# Altium project Emerald_7020.PrjPcb
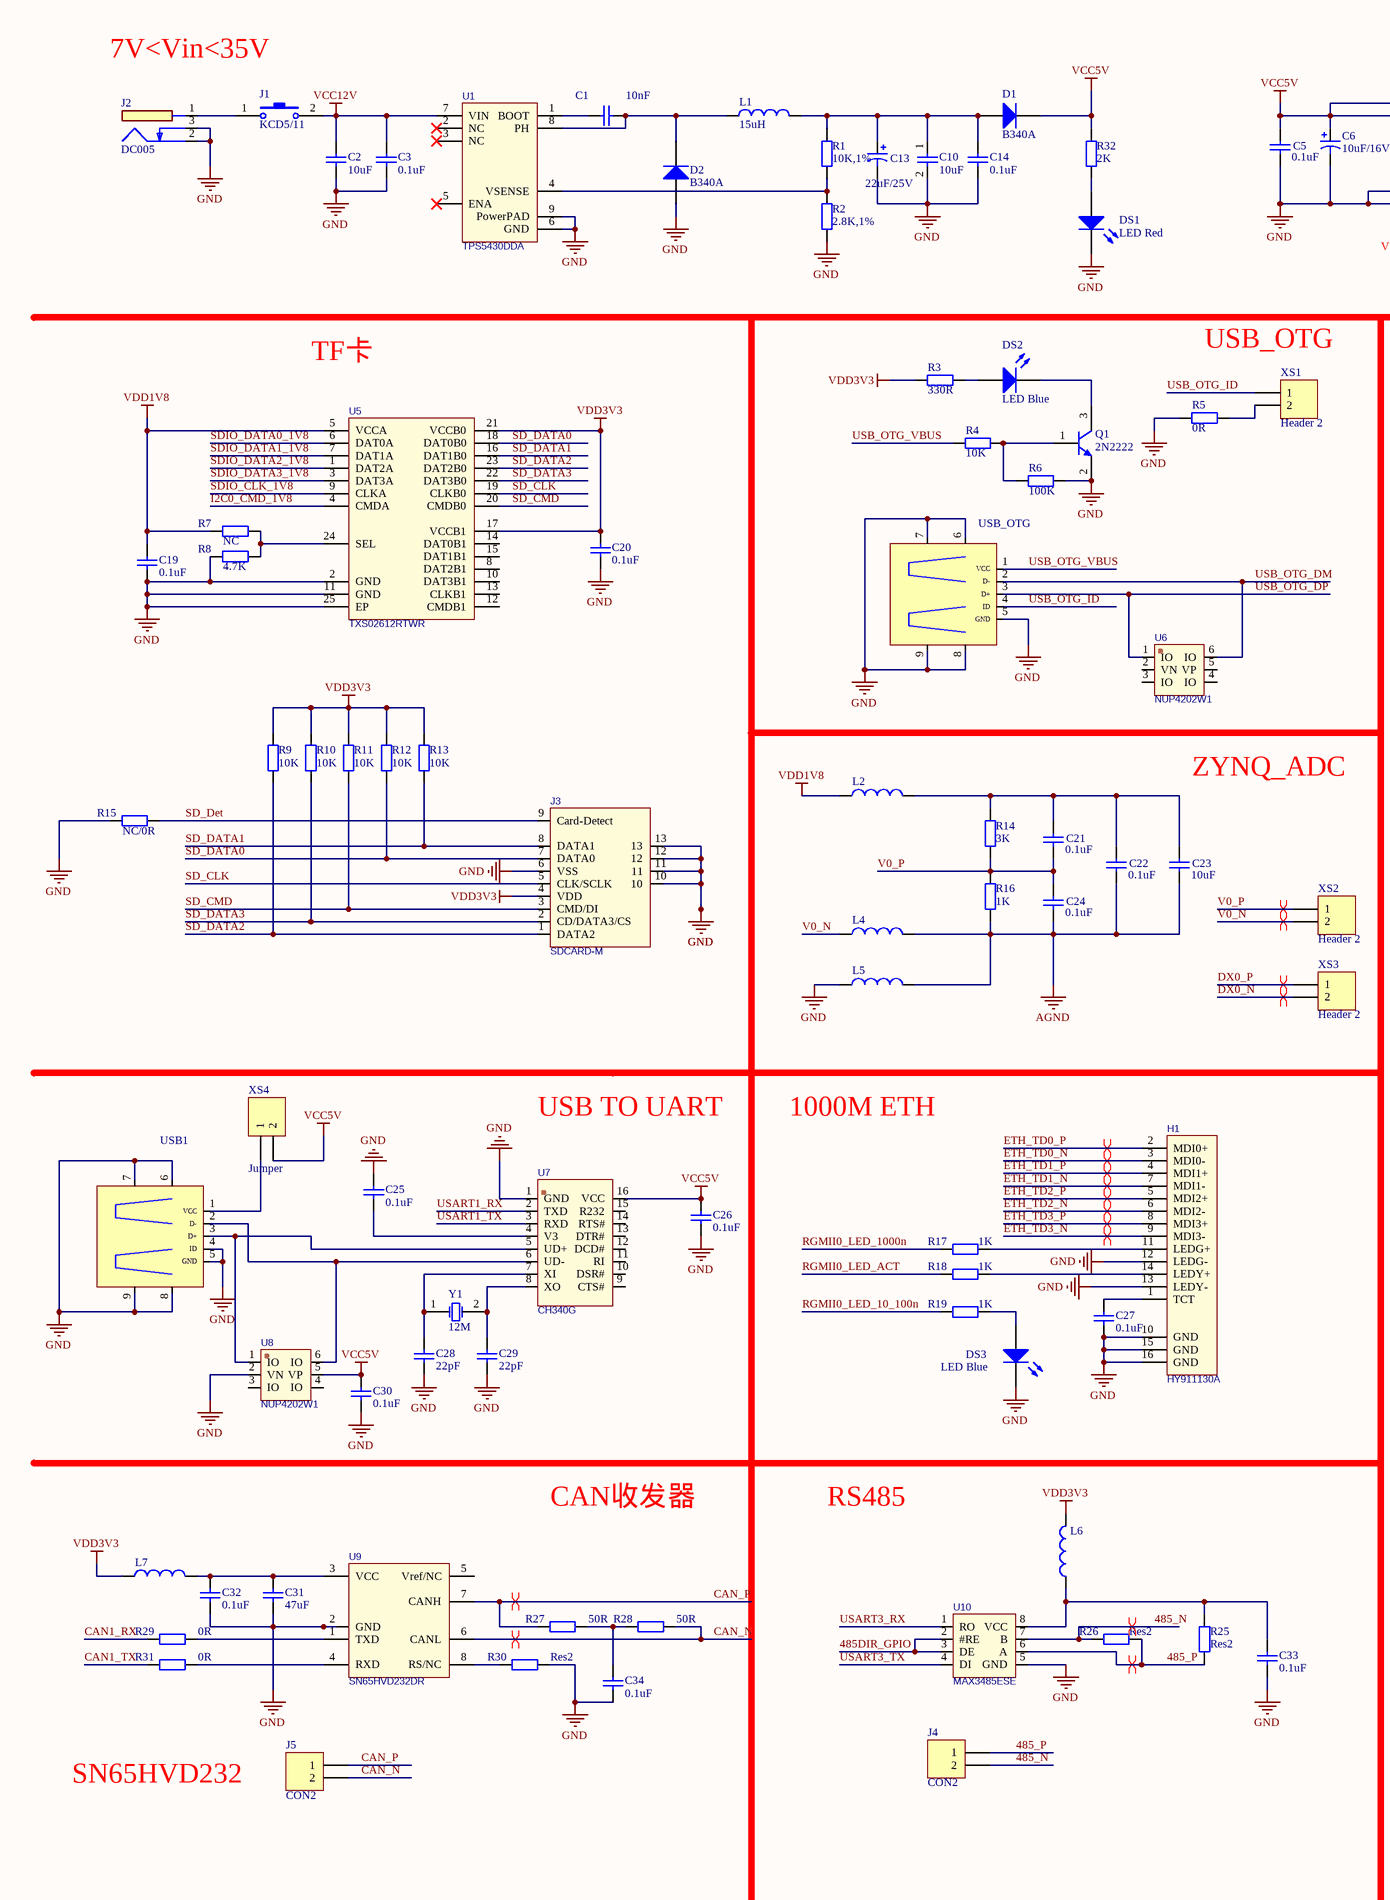
[diagram p0: ZYNQ_Motherboard_final.SchDoc, left]
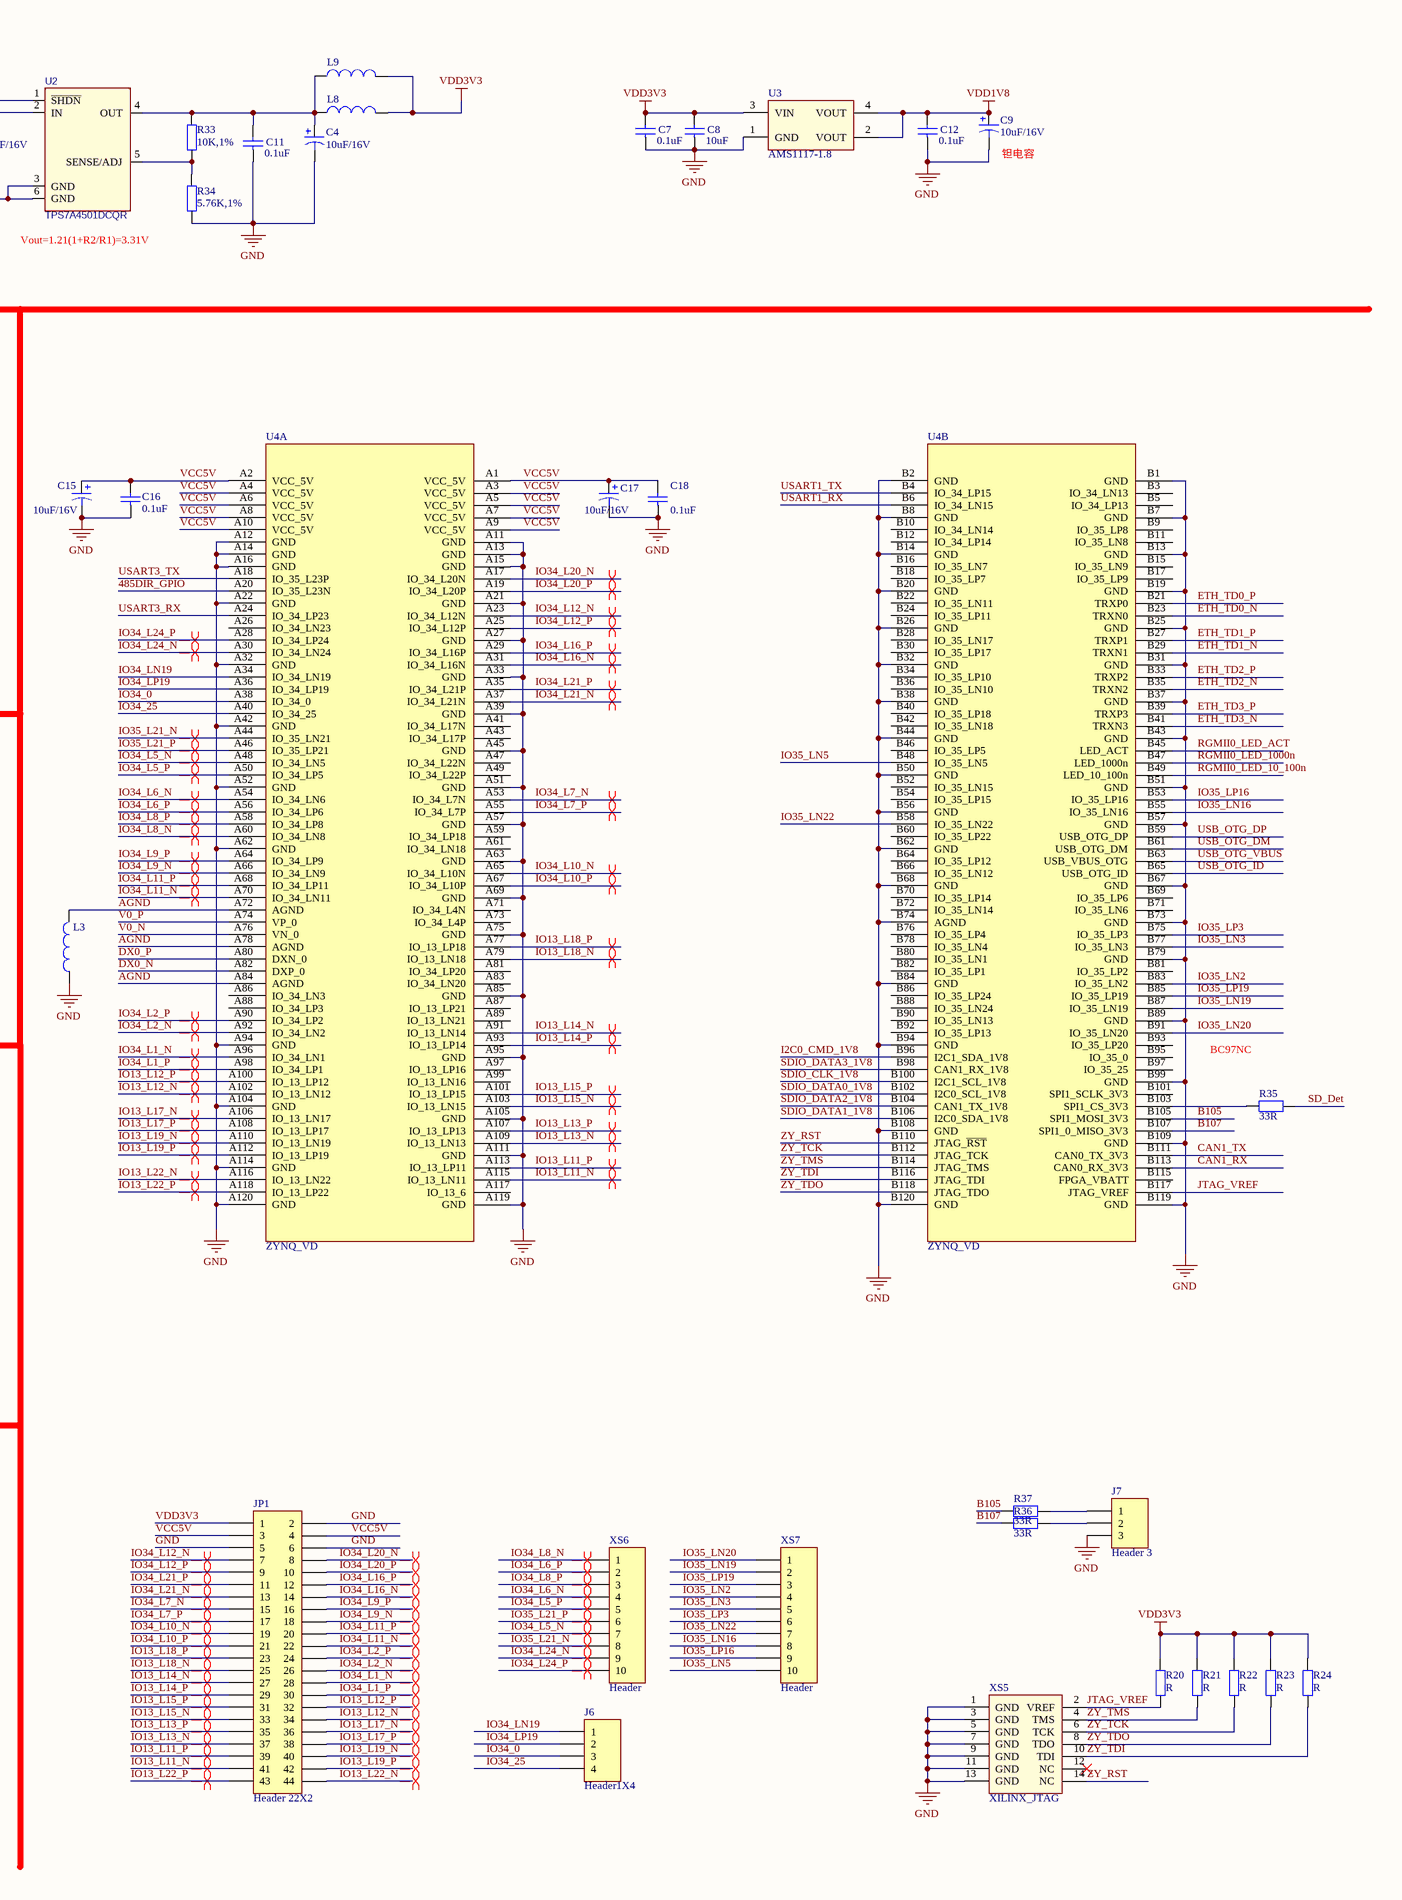
[diagram p1: ZYNQ_Motherboard_final.SchDoc, right]
1 sheet, 115 parts. Net scope: global (net labels, ports and power ports of the same name join across sheets).
Board file: ZYNQ_Motherboard_final.PcbDoc

## Sheet ZYNQ_Motherboard_final.SchDoc
size A2

### Parts
C1  10nF  [0603]
C2  10uF  [0805]
C3  0.1uF  [0603]
C4  10uF/16V  [shape_c]
C5  0.1uF  [0603]
C6  10uF/16V  [shape_c]
C7  0.1uF  [0603]
C8  10uF  [0805]
C9  10uF/16V  [shape_c]
C10  10uF  [0805]
C11  0.1uF  [0603]
C12  0.1uF  [0603]
C13  22uF/25V  [shape_c]
C14  0.1uF  [0603]
C15  10uF/16V  [shape_c]
C16  0.1uF  [0603]
C17  10uF/16V  [shape_c]
C18  0.1uF  [0603]
C19  0.1uF  [0603]
C20  0.1uF  [0603]
C21  0.1uF  [0603]
C22  0.1uF  [0603]
C23  10uF  [0603]
C24  0.1uF  [0603]
C25  0.1uF  [0603]
C26  0.1uF  [0603]
C27  0.1uF  [0603]
C28  22pF  [0603]
C29  22pF  [0603]
C30  0.1uF  [0603]
C31  47uF  [0805]
C32  0.1uF  [0603]
C33  0.1uF  [0603]
C34  0.1uF  [0603]
D1  B340A  [SMA (DO-214AC)]
D2  B340A  [SMA (DO-214AC)]
DS1  LED Red  [SMDLED]
DS2  LED Blue  [SMDLED]
DS3  LED Blue  [SMDLED]
H1  HY911130A  [RJ45_1000M]
J1  KCD5/11  [KCD5/11]
J2  DC005  [DC005]
J3  SDCARD-M  [SDCARD-M]
J4  CON2  [白色插座2]
J5  CON2  [白色插座2]
J6  Header1X4  [1X4_2.54]
J7  Header 3  [HDR1X3]
JP1  Header 22X2  [2x22_2.54]
L1  15uH  [L-SMD-12x12x10]
L2  MPZ1608B471ATA00  [0603]  (value not drawn)
L3  MPZ1608B471ATA00  [0603]  (value not drawn)
L4  MPZ1608B471ATA00  [0603]  (value not drawn)
L5  MPZ1608B471ATA00  [0603]  (value not drawn)
L6  MPZ1608B471ATA00  [0603]  (value not drawn)
L7  MPZ1608B471ATA00  [0603]  (value not drawn)
L8  MPZ1608B471ATA00  [0603]  (value not drawn)
L9  MPZ1608B471ATA00  [0603]  (value not drawn)
Q1  2N2222  [SOT-23]
R1  10K,1%  [0603]
R2  2.8K,1%  [0603]
R3  330R  [0603]
R4  10K  [0603]
R5  0R  [0603]
R6  100K  [0603]
R7  NC  [0603]
R8  4.7K  [0603]
R9  10K  [0603]
R10  10K  [0603]
R11  10K  [0603]
R12  10K  [0603]
R13  10K  [0603]
R14  3K  [0603]
R15  NC/0R  [0603]
R16  1K  [0603]
R17  1K  [0603]
R18  1K  [0603]
R19  1K  [0603]
R20  R  [0603]
R21  R  [0603]
R22  R  [0603]
R23  R  [0603]
R24  R  [0603]
R25  Res2  [0603]
R26  Res2  [0603]
R27  50R  [0603]
R28  50R  [0603]
R29  0R  [0603]
R30  Res2  [0603]
R31  0R  [0603]
R32  2K  [0603]
R33  10K,1%  [0603]
R34  5.76K,1%  [0603]
R35  33R  [0603]
R36  33R  [0603]
R37  33R  [0603]
U1  TPS5430DDA  [SOIC8-PAD]
U2  TPS7A4501DCQR  [SOT223-6]
U3  AMS1117-1.8  [SOT-223]
U4  ZYNQ_VD  [ZYNQ_VD]  (parts A,B of 2)
U5  TXS02612RTWR  [WQFN24_PAD]
U6  NUP4202W1  [SOT-363]
U7  CH340G  [SOP16M]
U8  NUP4202W1  [SOT-363]
U9  SN65HVD232DR  [SOIC8]
U10  MAX3485ESE  [SOP8]
USB1  USB  [USB/SM0.8-6H5]  (value not drawn)
USB_OTG  USB  [USB/SM0.8-6H5]  (value not drawn)
XS1  Header 2  [1X2_2.54]
XS2  Header 2  [1X2_2.54]
XS3  Header 2  [1X2_2.54]
XS4  Jumper  [1X2_2.54]
XS5  XILINX_JTAG  [JTAG14-2.0]
XS6  Header  [JTAG_10]
XS7  Header  [1x9_2.0]
Y1  12M  [晶振]

### Nets
AGND: C22.2 C23.2 C24.2 L3.2 L4.2 L5.2 R16.2 U4.A72(AGND) U4.A78(AGND) U4.A84(AGND)
GND: C2.2 C3.2 C4.2 C5.2 C6.2 C7.1 C8.1 C9.2 C10.2 C11.1 C12.1 C13.2 C14.2 C15.2 C16.2 C17.2 C18.2 C19.1 C20.1 C25.1 C26.2 C27.2 C28.1 C29.1 C30.1 C31.2 C32.2 C33.2 C34.2 D2.1(A) DS1.2(K) DS3.2(K) H1.10(GND) H1.12(LEDG-) H1.13(LEDY-) H1.15(GND) H1.16(GND) J2.2 J2.3 J3.6(VSS) J3.10 J3.11 J3.12 J3.13 J7.3 JP1.2 JP1.5 JP1.6 L3.1 L5.1 Q1.2(E) R2.2 R5.1 R6.2 R8.1 R15.1 R30.1 R34.2 U1.6(GND) U1.9(PowerPAD) U2.3(GND) U2.6(GND) U3.1(GND) U4.A11(GND) U4.A12(GND) U4.A13(GND) U4.A14(GND) U4.A15(GND) U4.A16(GND) U4.A21(GND) U4.A22(GND) U4.A27(GND) U4.A32(GND) U4.A33(GND) U4.A39(GND) U4.A42(GND) U4.A45(GND) U4.A51(GND) U4.A52(GND) U4.A57(GND) U4.A62(GND) U4.A63(GND) U4.A69(GND) U4.A75(GND) U4.A85(GND) U4.A94(GND) U4.A95(GND) U4.A104(GND) U4.A105(GND) U4.A111(GND) U4.A114(GND) U4.A119(GND) U4.A120(GND) U4.B1(GND) U4.B2(GND) U4.B7(GND) U4.B8(GND) U4.B13(GND) U4.B14(GND) U4.B19(GND) U4.B20(GND) U4.B25(GND) U4.B26(GND) U4.B31(GND) U4.B32(GND) U4.B37(GND) U4.B38(GND) U4.B43(GND) U4.B44(GND) U4.B50(GND) U4.B51(GND) U4.B56(GND) U4.B57(GND) U4.B62(GND) U4.B67(GND) U4.B68(GND) U4.B73(GND) U4.B74(AGND) U4.B79(GND) U4.B84(GND) U4.B89(GND) U4.B94(GND) U4.B99(GND) U4.B108(GND) U4.B109(GND) U4.B119(GND) U4.B120(GND) U5.2(GND) U5.11(GND) U5.25(EP) U7.1(GND) U8.2(VN) U9.2(GND) U10.5(GND) USB1.4(ID) USB1.5(GND) USB1.6 USB1.7 USB1.8 USB1.9 USB_OTG.5(GND) USB_OTG.6 USB_OTG.7 USB_OTG.8 USB_OTG.9 XS5.1(GND) XS5.3(GND) XS5.5(GND) XS5.7(GND) XS5.9(GND) XS5.11(GND) XS5.13(GND)
VCC5V: C5.1 C6.1 C15.1 C16.1 C17.1 C18.1 C26.1 C30.2 D1.2(K) JP1.3 JP1.4 R32.1 U2.1(~{SHDN}) U2.2(IN) U4.A1(VCC_5V) U4.A2(VCC_5V) U4.A3(VCC_5V) U4.A4(VCC_5V) U4.A5(VCC_5V) U4.A6(VCC_5V) U4.A7(VCC_5V) U4.A8(VCC_5V) U4.A9(VCC_5V) U4.A10(VCC_5V) U7.16(VCC) U8.5(VP) XS4.2
VCC12V: C2.1 C3.1 J1.2 U1.7(VIN)
VDD1V8: C9.1 C12.2 C19.2 L2.1 R7.1 U3.2(VOUT) U3.4(VOUT) U5.5(VCCA)
VDD3V3: C7.2 C8.2 C20.2 J3.4(VDD) JP1.1 L6.2 L7.1 L8.2 L9.2 R3.1 R9.1 R10.1 R11.1 R12.1 R13.1 R20.2 R21.2 R22.2 R23.2 R24.2 U3.3(VIN) U5.17(VCCB1) U5.21(VCCB0)
485_N: J4.2 R26.1 U10.7(B)
485_P: J4.1 R25.1 R26.2 U10.6(A)
485DIR_GPIO: U4.A20(IO_35_L23N) U10.2(#RE) U10.3(DE)
B105: R37.1 U4.B105(SPI1_MOSI_3V3)
B107: R36.1 U4.B107(SPI1_0_MISO_3V3)
CAN1_RX: R29.1 U4.B113(CAN0_RX_3V3)
CAN1_TX: R31.1 U4.B111(CAN0_TX_3V3)
CAN_N: J5.2 R28.2 U9.6(CANL)
CAN_P: J5.1 R27.1 U9.7(CANH)
DX0_N: U4.A82(DXP_0) XS3.2
DX0_P: U4.A80(DXN_0) XS3.1
ETH_TD0_N: H1.3(MDI0-) U4.B23(TRXN0)
ETH_TD0_P: H1.2(MDI0+) U4.B21(TRXP0)
ETH_TD1_N: H1.7(MDI1-) U4.B29(TRXN1)
ETH_TD1_P: H1.4(MDI1+) U4.B27(TRXP1)
ETH_TD2_N: H1.6(MDI2-) U4.B35(TRXN2)
ETH_TD2_P: H1.5(MDI2+) U4.B33(TRXP2)
ETH_TD3_N: H1.9(MDI3-) U4.B41(TRXN3)
ETH_TD3_P: H1.8(MDI3+) U4.B39(TRXP3)
I2C0_CMD_1V8: U4.B96(I2C1_SDA_1V8) U5.4(CMDA)
IO13_L11_N: JP1.41 U4.A115(IO_13_LN11)
IO13_L11_P: JP1.39 U4.A113(IO_13_LP11)
IO13_L12_N: JP1.34 U4.A102(IO_13_LN12)
IO13_L12_P: JP1.32 U4.A100(IO_13_LP12)
IO13_L13_N: JP1.37 U4.A109(IO_13_LN13)
IO13_L13_P: JP1.35 U4.A107(IO_13_LP13)
IO13_L14_N: JP1.27 U4.A91(IO_13_LN14)
IO13_L14_P: JP1.29 U4.A93(IO_13_LP14)
IO13_L15_N: JP1.33 U4.A103(IO_13_LN15)
IO13_L15_P: JP1.31 U4.A101(IO_13_LP15)
IO13_L17_N: JP1.36 U4.A106(IO_13_LN17)
IO13_L17_P: JP1.38 U4.A108(IO_13_LP17)
IO13_L18_N: JP1.25 U4.A79(IO_13_LN18)
IO13_L18_P: JP1.23 U4.A77(IO_13_LP18)
IO13_L19_N: JP1.40 U4.A110(IO_13_LN19)
IO13_L19_P: JP1.42 U4.A112(IO_13_LP19)
IO13_L22_N: JP1.44 U4.A116(IO_13_LN22)
IO13_L22_P: JP1.43 U4.A118(IO_13_LP22)
IO34_0: J6.3 U4.A38(IO_34_0)
IO34_25: J6.4 U4.A40(IO_34_25)
IO34_L1_N: JP1.28 U4.A96(IO_34_LN1)
IO34_L1_P: JP1.30 U4.A98(IO_34_LP1)
IO34_L2_N: JP1.26 U4.A92(IO_34_LN2)
IO34_L2_P: JP1.24 U4.A90(IO_34_LP2)
IO34_L5_N: U4.A48(IO_34_LN5) XS6.7
IO34_L5_P: U4.A50(IO_34_LP5) XS6.5
IO34_L6_N: U4.A54(IO_34_LN6) XS6.4
IO34_L6_P: U4.A56(IO_34_LP6) XS6.2
IO34_L7_N: JP1.15 U4.A53(IO_34_L7N)
IO34_L7_P: JP1.17 U4.A55(IO_34_L7P)
IO34_L8_N: U4.A60(IO_34_LN8) XS6.1
IO34_L8_P: U4.A58(IO_34_LP8) XS6.3
IO34_L9_N: JP1.18 U4.A66(IO_34_LN9)
IO34_L9_P: JP1.16 U4.A64(IO_34_LP9)
IO34_L10_N: JP1.19 U4.A65(IO_34_L10N)
IO34_L10_P: JP1.21 U4.A67(IO_34_L10P)
IO34_L11_N: JP1.22 U4.A70(IO_34_LN11)
IO34_L11_P: JP1.20 U4.A68(IO_34_LP11)
IO34_L12_N: JP1.7 U4.A23(IO_34_L12N)
IO34_L12_P: JP1.9 U4.A25(IO_34_L12P)
IO34_L16_N: JP1.14 U4.A31(IO_34_L16N)
IO34_L16_P: JP1.12 U4.A29(IO_34_L16P)
IO34_L20_N: JP1.8 U4.A17(IO_34_L20N)
IO34_L20_P: JP1.10 U4.A19(IO_34_L20P)
IO34_L21_N: JP1.13 U4.A37(IO_34_L21N)
IO34_L21_P: JP1.11 U4.A35(IO_34_L21P)
IO34_L24_N: U4.A30(IO_34_LN24) XS6.9
IO34_L24_P: U4.A28(IO_34_LP24) XS6.10
IO34_LN19: J6.1 U4.A34(IO_34_LN19)
IO34_LP19: J6.2 U4.A36(IO_34_LP19)
IO35_L21_N: U4.A44(IO_35_LN21) XS6.8
IO35_L21_P: U4.A46(IO_35_LP21) XS6.6
IO35_LN2: U4.B83(IO_35_LN2) XS7.4
IO35_LN3: U4.B77(IO_35_LN3) XS7.5
IO35_LN5: U4.B48(IO_35_LN5) XS7.10
IO35_LN16: U4.B55(IO_35_LN16) XS7.8
IO35_LN19: U4.B87(IO_35_LN19) XS7.2
IO35_LN20: U4.B91(IO_35_LN20) XS7.1
IO35_LN22: U4.B58(IO_35_LN22) XS7.7
IO35_LP3: U4.B75(IO_35_LP3) XS7.6
IO35_LP16: U4.B53(IO_35_LP16) XS7.9
IO35_LP19: U4.B85(IO_35_LP19) XS7.3
JTAG_VREF: R20.1 U4.B117(JTAG_VREF) XS5.2(VREF)
RGMII0_LED_10_100n: R19.1 U4.B49(LED_10_100n)
RGMII0_LED_1000n: R17.1 U4.B47(LED_1000n)
RGMII0_LED_ACT: R18.1 U4.B45(LED_ACT)
SD_CLK: J3.5(CLK/SCLK) U5.19(CLKB0)
SD_CMD: J3.3(CMD/DI) R11.2 U5.20(CMDB0)
SD_DATA0: J3.7(DATA0) R12.2 U5.18(DAT0B0)
SD_DATA1: J3.8(DATA1) R13.2 U5.16(DAT1B0)
SD_DATA2: J3.1(DATA2) R9.2 U5.23(DAT2B0)
SD_DATA3: J3.2(CD/DATA3/CS) R10.2 U5.22(DAT3B0)
SD_Det: J3.9(Card-Detect) R15.2 R35.1
SDIO_CLK_1V8: U4.B100(I2C1_SCL_1V8) U5.9(CLKA)
SDIO_DATA0_1V8: U4.B102(I2C0_SCL_1V8) U5.6(DAT0A)
SDIO_DATA1_1V8: U4.B106(I2C0_SDA_1V8) U5.7(DAT1A)
SDIO_DATA2_1V8: U4.B104(CAN1_TX_1V8) U5.1(DAT2A)
SDIO_DATA3_1V8: U4.B98(CAN1_RX_1V8) U5.3(DAT3A)
USART1_RX: U4.B6(IO_34_LN15) U7.2(TXD)
USART1_TX: U4.B4(IO_34_LP15) U7.3(RXD)
USART3_RX: U4.A24(IO_34_LP23) U10.1(RO)
USART3_TX: U4.A18(IO_35_L23P) U10.4(DI)
USB_OTG_DM: U4.B61(USB_OTG_DM) U6.6(IO) USB_OTG.2(D-)
USB_OTG_DP: U4.B59(USB_OTG_DP) U6.1(IO) USB_OTG.3(D+)
USB_OTG_ID: U4.B65(USB_OTG_ID) USB_OTG.4(ID) XS1.1
USB_OTG_VBUS: R4.1 U4.B63(USB_VBUS_OTG) USB_OTG.1(VCC)
V0_N: L4.1 U4.A76(VN_0) XS2.2
V0_P: C21.2 C24.1 R14.2 R16.1 U4.A74(VP_0) XS2.1
ZY_RST: U4.B110(JTAG_~{RST}) XS5.14(NC)
ZY_TCK: R22.1 U4.B112(JTAG_TCK) XS5.6(TCK)
ZY_TDI: R24.1 U4.B116(JTAG_TDI) XS5.10(TDI)
ZY_TDO: R23.1 U4.B118(JTAG_TDO) XS5.8(TDO)
ZY_TMS: R21.1 U4.B114(JTAG_TMS) XS5.4(TMS)
NetC1_1: C1.1 U1.1(BOOT)
NetC1_2: C1.2 D2.2(K) L1.1 U1.8(PH)
NetC4_1: C4.1 C11.2 L8.1 L9.1 R33.1 U2.4(OUT)
NetC10_1: C10.1 C13.1 C14.1 D1.1(A) L1.2 R1.1
NetC21_1: C21.1 C22.1 C23.1 L2.2 R14.1
NetC25_2: C25.2 U7.4(V3)
NetC27_1: C27.1 H1.1(TCT)
NetC28_2: C28.2 U7.7(XI) Y1.1(OSC1)
NetC29_2: C29.2 U7.8(XO) Y1.2(OSC3)
NetC31_1: C31.1 C32.1 L7.2 U9.3(VCC)
NetC33_1: C33.1 L6.1 R25.2 U10.8(VCC)
NetC34_1: C34.1 R27.2 R28.1
NetDS1_1: DS1.1(A) R32.2
NetDS2_1: DS2.1(A) R3.2
NetDS2_2: DS2.2(K) Q1.3(C)
NetDS3_1: DS3.1(A) R19.2
NetH1_11: H1.11(LEDG+) R17.2
NetH1_14: H1.14(LEDY+) R18.2
NetJ1_1: J1.1 J2.1
NetJ7_1: J7.1 R37.2
NetJ7_2: J7.2 R36.2
NetQ1_1: Q1.1(B) R4.2 R6.1
NetR1_2: R1.2 R2.1 U1.4(VSENSE)
NetR5_2: R5.2 XS1.2
NetR7_2: R7.2 R8.2 U5.24(SEL)
NetR29_2: R29.2 U9.1(TXD)
NetR30_2: R30.2 U9.8(RS/NC)
NetR31_2: R31.2 U9.4(RXD)
NetR33_2: R33.2 R34.1 U2.5(SENSE/ADJ)
NetR35_2: R35.2 U4.B103(SPI1_CS_3V3)
NetU7_5: U7.5(UD+) U8.1(IO) USB1.3(D+)
NetU7_6: U7.6(UD-) U8.6(IO) USB1.2(D-)
NetUSB1_1: USB1.1(VCC) XS4.1

Not connected (* = marked no-connect by the designer): U1 2(NC)* 3(NC)* 5(ENA)*; U4 A26(IO_34_LN23) A41(IO_34_L17N) A43(IO_34_L17P) A47(IO_34_L22N) A49(IO_34_L22P) A59(IO_34_LP18) A61(IO_34_LN18) A71(IO_34_L4N) A73(IO_34_L4P) A81(IO_34_LP20) A83(IO_34_LN20) A86(IO_34_LN3) A87(IO_13_LP21) A88(IO_34_LP3) A89(IO_13_LN21) A97(IO_13_LP16) A99(IO_13_LN16) A117(IO_13_6) B3(IO_34_LN13) B5(IO_34_LP13) B9(IO_35_LP8) B10(IO_34_LN14) B11(IO_35_LN8) B12(IO_34_LP14) B15(IO_35_LN9) B16(IO_35_LN7) B17(IO_35_LP9) B18(IO_35_LP7) B22(IO_35_LN11) B24(IO_35_LP11) B28(IO_35_LN17) B30(IO_35_LP17) B34(IO_35_LP10) B36(IO_35_LN10) B40(IO_35_LP18) B42(IO_35_LN18) B46(IO_35_LP5) B52(IO_35_LN15) B54(IO_35_LP15) B60(IO_35_LP22) B64(IO_35_LP12) B66(IO_35_LN12) B69(IO_35_LP6) B70(IO_35_LP14) B71(IO_35_LN6) B72(IO_35_LN14) B76(IO_35_LP4) B78(IO_35_LN4) B80(IO_35_LN1) B81(IO_35_LP2) B82(IO_35_LP1) B86(IO_35_LP24) B88(IO_35_LN24) B90(IO_35_LN13) B92(IO_35_LP13) B93(IO_35_LP20) B95(IO_35_0) B97(IO_35_25) B101(SPI1_SCLK_3V3) B115(FPGA_VBATT); U5 8(DAT2B1) 10(DAT3B1) 12(CMDB1) 13(CLKB1) 14(DAT0B1) 15(DAT1B1); U6 2(VN) 3(IO) 4(IO) 5(VP); U7 9(CTS#) 10(DSR#) 11(RI) 12(DCD#) 13(DTR#) 14(RTS#) 15(R232); U8 3(IO) 4(IO); U9 5(Vref/NC); XS5 12(NC)*

### Layout directives
differential pair: 485_N, 485_P, CAN_N, CAN_P, DX0_N, DX0_P, ETH_TD0_N, ETH_TD0_P, ETH_TD1_N, ETH_TD1_P, ETH_TD2_N, ETH_TD2_P, ETH_TD3_N, ETH_TD3_P, IO13_L11_N, IO13_L11_P, IO13_L12_N, IO13_L12_P, IO13_L13_N, IO13_L13_P, IO13_L14_N, IO13_L14_P, IO13_L15_N, IO13_L15_P, IO13_L17_N, IO13_L17_P, IO13_L18_N, IO13_L18_P, IO13_L19_N, IO13_L19_P, IO13_L22_N, IO13_L22_P, IO34_L1_N, IO34_L1_P, IO34_L2_N, IO34_L2_P, IO34_L5_N, IO34_L5_P, IO34_L6_N, IO34_L6_P, IO34_L7_N, IO34_L7_P, IO34_L8_N, IO34_L8_P, IO34_L9_N, IO34_L9_P, IO34_L10_N, IO34_L10_P, IO34_L11_N, IO34_L11_P, IO34_L12_N, IO34_L12_P, IO34_L16_N, IO34_L16_P, IO34_L20_N, IO34_L20_P, IO34_L21_N, IO34_L21_P, IO34_L24_N, IO34_L24_P, IO35_L21_N, IO35_L21_P, V0_N, V0_P

### Notes on the sheet
- 7V<Vin<35V
- (near C9) 钽电容
- Vout=1.21(1+R2/R1)=3.31V
- TF卡
- (near XS1) USB_OTG
- ZYNQ_ADC
- BC97NC
- USB TO UART
- 1000M ETH
- CAN收发器
- RS485
- SN65HVD232

### Library data of the parts
C1-C3 C5 C7 C8 C10-C12 C14 C16 C18-C34 = 0603-CAP-50V 100±5%
C4 C6 C9 C13 C15 C17 = Cap Pol1: Polarized Capacitor (Radial); Value: 10uF; Published: 8-Jun-2000; LatestRevisionDate: 17-Jul-2002; LatestRevisionNote: Re-released for DXP Platform.; PackageReference: RB7.6-15; Publisher: Altium Limited
D1 D2 = SMD_整流二极管_FSL14: 品牌: 固锝; 规格型号: FSL14; 存货编码: 801014200052; 描述: SO-123 1A 40V; 品名: 整流二极管
DS1-DS3 = 0805_发光二极管_红色: 品牌: EVERLIGHT; 规格型号: 17-21USRC/S530-XX/TR8; 存货编码: 801014200016; 描述: 0805 5V 25mA 红光; 品名: 发光二极管
H1 = HY911130A: BOM_Manufacturer: HANRUN; BOM_Supplier: LCSC; BOM_Manufacturer Part: HY911130A; BOM_Supplier Part: C55679; BOM_JLCPCB Part Class: Extended Part; spicePre: R; spiceSymbolName: HY911130A
J1 = SW-PB: Switch; Published: 24-Mar-1999; LatestRevisionDate: 17-Jul-2002; LatestRevisionNote: Re-released for DXP Platform.; PackageReference: SPST-2; Publisher: Altium Limited
J2 = CON-SOCJ-2155: Connector; Manufacturer_Name: Gravitech; Datasheet Link: http://www.produktinfo.conrad.com/datenblaetter/1500000-1599999/001582350-da-01-en-DC_EINBAUBUCHSE__SCHALTER_GESCHLOSSEN.pdf; Height: 11mm; Manufacturer_Part_Number: CON-SOCJ-2155; Mouser Part Number: 992-CON-SOCJ-2155; Mouser Price/Stock: https://www.mouser.co.uk/ProductDetail/Gravitech/CON-SOCJ-2155?qs=fkzBJ5HM%252BdCcpvFQyQZHtA%3D%3D
J3 = DM3CS-SF: BOM_Manufacturer: Hirose; Contributor: LCSC; BOM_Supplier: LCSC; BOM_Supplier Part: C202111; BOM_Manufacturer Part: DM3CS-SF; BOM_JLCPCB Part Class: Extended Part; spicePre: T; spiceSymbolName: DM3CS-SF
J4 J5 XS1-XS4 = Header 2: Header, 2-Pin; LatestRevisionDate: 17-Jul-2002; LatestRevisionNote: Re-released for DXP Platform.; Publisher: Altium Limited
J6 = Header 4: Header, 4-Pin; LatestRevisionDate: 17-Jul-2002; LatestRevisionNote: Re-released for DXP Platform.; Publisher: Altium Limited
J7 = Header 3: Header, 3-Pin; LatestRevisionDate: 17-Jul-2002; LatestRevisionNote: Re-released for DXP Platform.; Publisher: Altium Limited
JP1 = Header 22X2: Header, 22-Pin, Dual row; LatestRevisionDate: 17-Jul-2002; LatestRevisionNote: Re-released for DXP Platform.; Publisher: Altium Limited
L1-L9 = Inductor: Code_IEC: 1005; Published: 8-Jun-2000; LatestRevisionDate: 29-May-2009; LatestRevisionNote: IPC-7351 Footprint Added.; PackageReference: 0402-A; Publisher: Altium Limited; PackageDescription: Chip Inductor; Code_JEITA: 0402
Q1 = NPN_三极管_S9013 SOT-23: 品牌: JCET; 描述: SOT-23 500mA 40V; 规格型号: S9013; 存货编码: 801014300001; 品名: 三极管
R1-R37 = Res2: Resistor; Published: 8-Jun-2000; LatestRevisionDate: 17-Jul-2002; LatestRevisionNote: Re-released for DXP Platform.; PackageReference: AXIAL-0.4; Publisher: Altium Limited; PackageDescription: Axial Device, Thru-Hole; 2 Leads; 0.4 in Pin Spacing
U1 = TPS5430DDAR: BOM_Manufacturer: TI; BOM_Supplier: LCSC; BOM_Manufacturer Part: TPS5430DDAR; BOM_Supplier Part: C9864; BOM_JLCPCB Part Class: Basic Part; spicePre: U; spiceSymbolName: TPS5430DDAR
U2 = TPS7A4501DCQR: BOM_Manufacturer: TI(德州仪器); Contributor: LCSC; BOM_Supplier: LCSC; BOM_Supplier Part: C840094; BOM_Manufacturer Part: TPS7A4501DCQR; BOM_JLCPCB Part Class: Extended Part; spicePre: U; spiceSymbolName: TPS7A4501DCQR
U4 = ZYNQ
U5 = TXS02612RTWR: BOM_Manufacturer: Texas Instruments; Contributor: LCSC; BOM_Supplier: LCSC; BOM_Supplier Part: C140276; BOM_Manufacturer Part: TXS02612RTWR; BOM_JLCPCB Part Class: Extended Part; spicePre: U; spiceSymbolName: TXS02612RTWR
U6 U8 = NUP4202W1T2G: BOM_Manufacturer: ON; BOM_Supplier: LCSC; BOM_Manufacturer Part: NUP4202W1T2G; BOM_Supplier Part: C89319; BOM_JLCPCB Part Class: Extended Part; spicePre: D; spiceSymbolName: NUP4202W1T2G
U7 = CH340G: BOM_Manufacturer: WCH; timeStamp: 1468327462; BOM_Supplier: LCSC; BOM_Manufacturer Part: CH340G; BOM_Supplier Part: C14267; BOM_JLCPCB Part Class: Extended Part; spicePre: U; spiceSymbolName: CH340G
U9 = SN65HVD232DR: BOM_Manufacturer: TI; BOM_Supplier: LCSC; BOM_Manufacturer Part: SN65HVD232DR; BOM_Supplier Part: C30530; BOM_JLCPCB Part Class: Extended Part; spicePre: U; spiceSymbolName: SN65HVD232DR
U10 = MAX3485ESE: BOM_Manufacturer: UMW(Youtai Semiconductor Co., Ltd.); BOM_Manufacturer Part: MAX3485ESA; Contributor: LCSC; BOM_Supplier: LCSC; BOM_Supplier Part: C668204; BOM_JLCPCB Part Class: Extended Part; spicePre: U; spiceSymbolName: MAX3485ESA
USB1 USB_OTG = USB-micro
XS6 XS7 = Header 10: Header, 10-Pin; LatestRevisionDate: 17-Jul-2002; LatestRevisionNote: Re-released for DXP Platform.; Publisher: Altium Limited
Y1 = 晶振(DIP 3)_4MHz: 品牌: ECEC; 规格型号: HC-49S/ZTT4.0MT; 存货编码: 8010153000012; 描述: DIP-3 L4mm 4MHz 10pF ±0.5% -40℃～85℃; 品名: 晶振